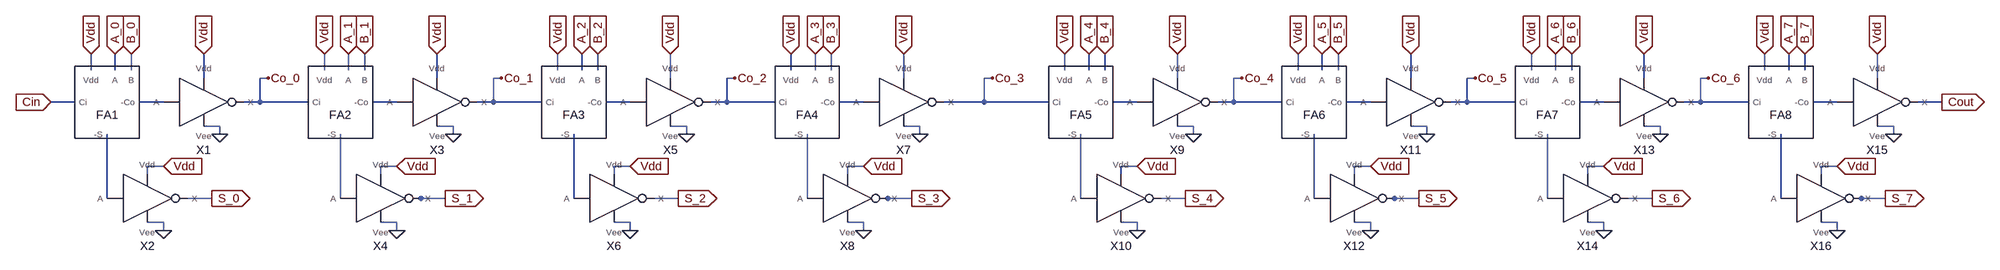
[diagram p0: schematic 8RCAX1.asc]
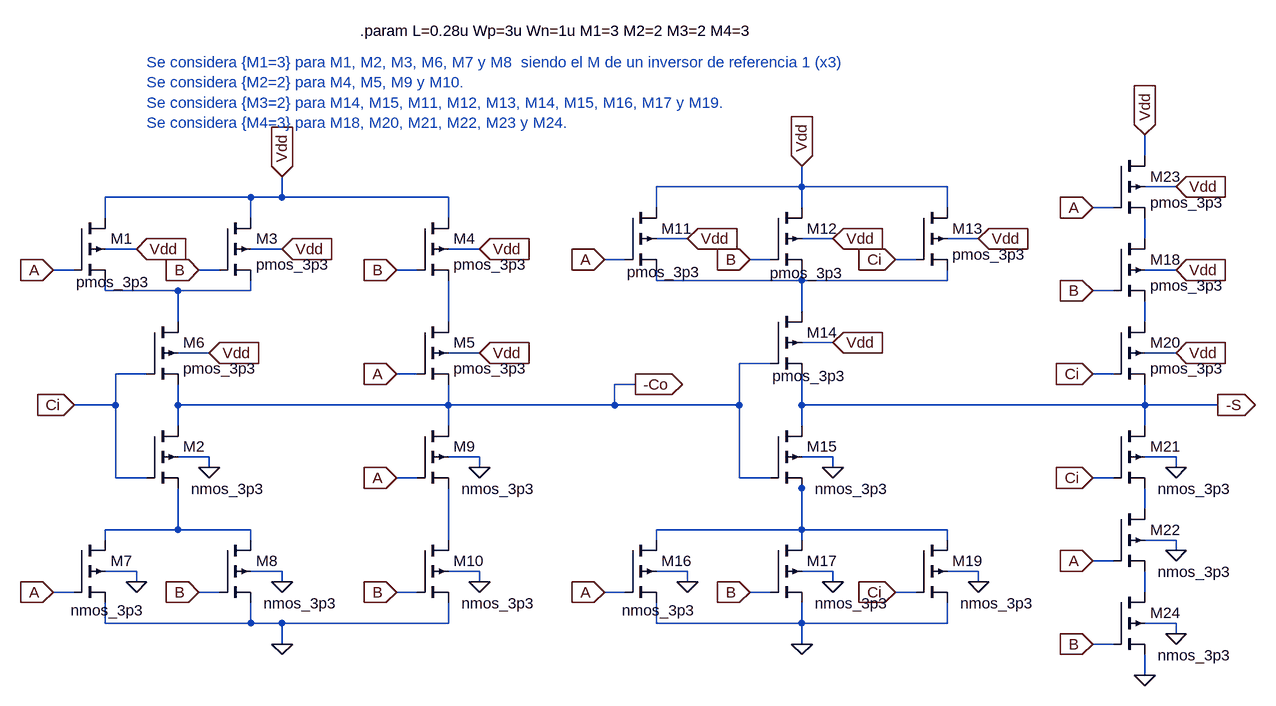
[diagram p1: sub-circuit fax1.asc]
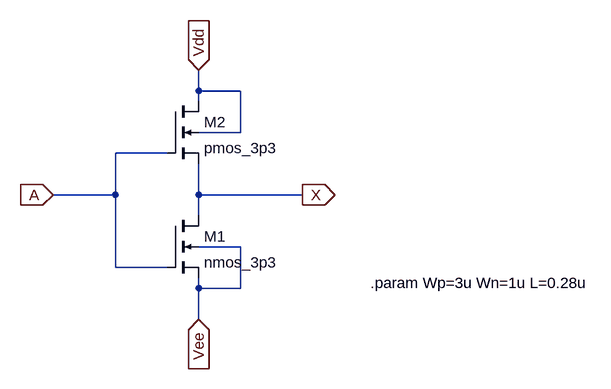
[diagram p2: sub-circuit invx1.asc]
8RCAX1.asc, the LTspice schematic file:
Version 4
SHEET 1 2936 680
WIRE -864 48 -864 16
WIRE -816 48 -816 16
WIRE -784 48 -784 16
WIRE -400 48 -400 16
WIRE -352 48 -352 16
WIRE -320 48 -320 16
WIRE 64 48 64 16
WIRE 112 48 112 16
WIRE 144 48 144 16
WIRE 528 48 528 16
WIRE 576 48 576 16
WIRE 608 48 608 16
WIRE 1072 48 1072 16
WIRE 1120 48 1120 16
WIRE 1152 48 1152 16
WIRE 1536 48 1536 16
WIRE 1584 48 1584 16
WIRE 1616 48 1616 16
WIRE 2000 48 2000 16
WIRE 2048 48 2048 16
WIRE 2080 48 2080 16
WIRE 2464 48 2464 16
WIRE 2512 48 2512 16
WIRE 2544 48 2544 16
WIRE -640 64 -640 16
WIRE -512 64 -528 64
WIRE -176 64 -176 16
WIRE -48 64 -64 64
WIRE 288 64 288 16
WIRE 416 64 400 64
WIRE 752 64 752 16
WIRE 928 64 912 64
WIRE 1296 64 1296 16
WIRE 1424 64 1408 64
WIRE 1760 64 1760 16
WIRE 1888 64 1872 64
WIRE 2224 64 2224 16
WIRE 2352 64 2336 64
WIRE 2688 64 2688 16
WIRE -896 112 -944 112
WIRE -720 112 -768 112
WIRE -528 112 -528 64
WIRE -528 112 -560 112
WIRE -432 112 -528 112
WIRE -256 112 -304 112
WIRE -64 112 -64 64
WIRE -64 112 -96 112
WIRE 32 112 -64 112
WIRE 208 112 160 112
WIRE 400 112 400 64
WIRE 400 112 368 112
WIRE 496 112 400 112
WIRE 672 112 624 112
WIRE 912 112 912 64
WIRE 912 112 832 112
WIRE 1040 112 912 112
WIRE 1216 112 1168 112
WIRE 1408 112 1408 64
WIRE 1408 112 1376 112
WIRE 1504 112 1408 112
WIRE 1680 112 1632 112
WIRE 1872 112 1872 64
WIRE 1872 112 1840 112
WIRE 1968 112 1872 112
WIRE 2144 112 2096 112
WIRE 2336 112 2336 64
WIRE 2336 112 2304 112
WIRE 2432 112 2336 112
WIRE 2608 112 2560 112
WIRE 2816 112 2768 112
WIRE -608 160 -640 160
WIRE -144 160 -176 160
WIRE 320 160 288 160
WIRE 784 160 752 160
WIRE 1328 160 1296 160
WIRE 1792 160 1760 160
WIRE 2256 160 2224 160
WIRE 2720 160 2688 160
WIRE -608 176 -608 160
WIRE -144 176 -144 160
WIRE 320 176 320 160
WIRE 784 176 784 160
WIRE 1328 176 1328 160
WIRE 1792 176 1792 160
WIRE 2256 176 2256 160
WIRE 2720 176 2720 160
WIRE -720 240 -752 240
WIRE -256 240 -288 240
WIRE 208 240 176 240
WIRE 672 240 640 240
WIRE 1216 240 1184 240
WIRE 1680 240 1648 240
WIRE 2144 240 2112 240
WIRE 2608 240 2576 240
WIRE -752 256 -752 240
WIRE -288 256 -288 240
WIRE 176 256 176 240
WIRE 640 256 640 240
WIRE 1184 256 1184 240
WIRE 1648 256 1648 240
WIRE 2112 256 2112 240
WIRE 2576 256 2576 240
WIRE -832 304 -832 176
WIRE -624 304 -672 304
WIRE -368 304 -368 176
WIRE -208 304 -224 304
WIRE -160 304 -208 304
WIRE 96 304 96 176
WIRE 304 304 256 304
WIRE 560 304 560 176
WIRE 720 304 704 304
WIRE 768 304 720 304
WIRE 1104 304 1104 176
WIRE 1312 304 1264 304
WIRE 1568 304 1568 176
WIRE 1728 304 1712 304
WIRE 1776 304 1728 304
WIRE 2032 304 2032 176
WIRE 2240 304 2192 304
WIRE 2496 304 2496 176
WIRE 2656 304 2640 304
WIRE 2704 304 2656 304
WIRE -720 352 -752 352
WIRE -256 352 -288 352
WIRE 208 352 176 352
WIRE 672 352 640 352
WIRE 1216 352 1184 352
WIRE 1680 352 1648 352
WIRE 2144 352 2112 352
WIRE 2608 352 2576 352
WIRE -720 368 -720 352
WIRE -256 368 -256 352
WIRE 208 368 208 352
WIRE 672 368 672 352
WIRE 1216 368 1216 352
WIRE 1680 368 1680 352
WIRE 2144 368 2144 352
WIRE 2608 368 2608 352
FLAG -864 16 Vdd
IOPIN -864 16 In
FLAG -640 16 Vdd
IOPIN -640 16 In
FLAG -608 176 0
FLAG -624 304 S_0
IOPIN -624 304 Out
FLAG -512 64 Co_0
FLAG -400 16 Vdd
IOPIN -400 16 In
FLAG -176 16 Vdd
IOPIN -176 16 In
FLAG -144 176 0
FLAG -160 304 S_1
IOPIN -160 304 Out
FLAG -48 64 Co_1
FLAG 64 16 Vdd
IOPIN 64 16 In
FLAG 288 16 Vdd
IOPIN 288 16 In
FLAG 320 176 0
FLAG 304 304 S_2
IOPIN 304 304 Out
FLAG 416 64 Co_2
FLAG 528 16 Vdd
IOPIN 528 16 In
FLAG 752 16 Vdd
IOPIN 752 16 In
FLAG 784 176 0
FLAG 768 304 S_3
IOPIN 768 304 Out
FLAG -720 240 Vdd
IOPIN -720 240 In
FLAG -256 240 Vdd
IOPIN -256 240 In
FLAG 208 240 Vdd
IOPIN 208 240 In
FLAG 672 240 Vdd
IOPIN 672 240 In
FLAG -720 368 0
FLAG -256 368 0
FLAG 208 368 0
FLAG 672 368 0
FLAG -816 16 A_0
IOPIN -816 16 In
FLAG -784 16 B_0
IOPIN -784 16 In
FLAG -352 16 A_1
IOPIN -352 16 In
FLAG -320 16 B_1
IOPIN -320 16 In
FLAG 112 16 A_2
IOPIN 112 16 In
FLAG 144 16 B_2
IOPIN 144 16 In
FLAG 576 16 A_3
IOPIN 576 16 In
FLAG 608 16 B_3
IOPIN 608 16 In
FLAG 1072 16 Vdd
IOPIN 1072 16 In
FLAG 1296 16 Vdd
IOPIN 1296 16 In
FLAG 1328 176 0
FLAG 1312 304 S_4
IOPIN 1312 304 Out
FLAG 1424 64 Co_4
FLAG 1536 16 Vdd
IOPIN 1536 16 In
FLAG 1760 16 Vdd
IOPIN 1760 16 In
FLAG 1792 176 0
FLAG 1776 304 S_5
IOPIN 1776 304 Out
FLAG 1888 64 Co_5
FLAG 2000 16 Vdd
IOPIN 2000 16 In
FLAG 2224 16 Vdd
IOPIN 2224 16 In
FLAG 2256 176 0
FLAG 2240 304 S_6
IOPIN 2240 304 Out
FLAG 2352 64 Co_6
FLAG 2464 16 Vdd
IOPIN 2464 16 In
FLAG 2688 16 Vdd
IOPIN 2688 16 In
FLAG 2720 176 0
FLAG 2704 304 S_7
IOPIN 2704 304 Out
FLAG 1216 240 Vdd
IOPIN 1216 240 In
FLAG 1680 240 Vdd
IOPIN 1680 240 In
FLAG 2144 240 Vdd
IOPIN 2144 240 In
FLAG 2608 240 Vdd
IOPIN 2608 240 In
FLAG 1216 368 0
FLAG 1680 368 0
FLAG 2144 368 0
FLAG 2608 368 0
FLAG 1120 16 A_4
IOPIN 1120 16 In
FLAG 1152 16 B_4
IOPIN 1152 16 In
FLAG 1584 16 A_5
IOPIN 1584 16 In
FLAG 1616 16 B_5
IOPIN 1616 16 In
FLAG 2048 16 A_6
IOPIN 2048 16 In
FLAG 2080 16 B_6
IOPIN 2080 16 In
FLAG 2512 16 A_7
IOPIN 2512 16 In
FLAG 2544 16 B_7
IOPIN 2544 16 In
FLAG -944 112 Cin
IOPIN -944 112 In
FLAG 2816 112 Cout
IOPIN 2816 112 Out
FLAG 928 64 Co_3
SYMBOL FAX1 -832 112 R0
SYMATTR InstName FA1
SYMBOL INVx1 -640 112 R0
SYMATTR InstName X1
SYMBOL INVx1 -752 304 R0
SYMATTR InstName X2
SYMBOL FAX1 -368 112 R0
SYMATTR InstName FA2
SYMBOL INVx1 -176 112 R0
SYMATTR InstName X3
SYMBOL INVx1 -288 304 R0
SYMATTR InstName X4
SYMBOL FAX1 96 112 R0
SYMATTR InstName FA3
SYMBOL INVx1 288 112 R0
SYMATTR InstName X5
SYMBOL INVx1 176 304 R0
SYMATTR InstName X6
SYMBOL FAX1 560 112 R0
SYMATTR InstName FA4
SYMBOL INVx1 752 112 R0
SYMATTR InstName X7
SYMBOL INVx1 640 304 R0
SYMATTR InstName X8
SYMBOL FAX1 1104 112 R0
SYMATTR InstName FA5
SYMBOL INVx1 1296 112 R0
SYMATTR InstName X9
SYMBOL INVx1 1184 304 R0
SYMATTR InstName X10
SYMBOL FAX1 1568 112 R0
SYMATTR InstName FA6
SYMBOL INVx1 1760 112 R0
SYMATTR InstName X11
SYMBOL INVx1 1648 304 R0
SYMATTR InstName X12
SYMBOL FAX1 2032 112 R0
SYMATTR InstName FA7
SYMBOL INVx1 2224 112 R0
SYMATTR InstName X13
SYMBOL INVx1 2112 304 R0
SYMATTR InstName X14
SYMBOL FAX1 2496 112 R0
SYMATTR InstName FA8
SYMBOL INVx1 2688 112 R0
SYMATTR InstName X15
SYMBOL INVx1 2576 304 R0
SYMATTR InstName X16

fax1.asc, the sub-circuit schematic file:
Version 4
SHEET 1 1704 1284
WIRE 1440 -784 1440 -816
WIRE 912 -736 912 -768
WIRE 912 -736 688 -736
WIRE 1136 -736 912 -736
WIRE 1488 -736 1440 -736
WIRE 64 -720 -160 -720
WIRE 112 -720 112 -752
WIRE 112 -720 64 -720
WIRE 368 -720 112 -720
WIRE 688 -704 688 -736
WIRE 912 -704 912 -736
WIRE 1136 -704 1136 -736
WIRE 1392 -704 1360 -704
WIRE -160 -688 -160 -720
WIRE 64 -688 64 -720
WIRE 368 -688 368 -720
WIRE 736 -656 688 -656
WIRE 960 -656 912 -656
WIRE 1184 -656 1136 -656
WIRE 1440 -656 1440 -688
WIRE -112 -640 -160 -640
WIRE 112 -640 64 -640
WIRE 416 -640 368 -640
WIRE 640 -624 608 -624
WIRE 864 -624 832 -624
WIRE 1088 -624 1056 -624
WIRE -208 -608 -240 -608
WIRE 16 -608 -16 -608
WIRE 320 -608 288 -608
WIRE 1488 -608 1440 -608
WIRE 688 -592 688 -608
WIRE 912 -592 912 -608
WIRE 912 -592 688 -592
WIRE 1136 -592 1136 -608
WIRE 1136 -592 912 -592
WIRE -160 -576 -160 -592
WIRE -48 -576 -160 -576
WIRE 64 -576 64 -592
WIRE 64 -576 -48 -576
WIRE 1392 -576 1360 -576
WIRE 912 -544 912 -592
WIRE -48 -528 -48 -576
WIRE 368 -528 368 -592
WIRE 1440 -528 1440 -560
WIRE 960 -496 912 -496
WIRE 0 -480 -48 -480
WIRE 416 -480 368 -480
WIRE 1488 -480 1440 -480
WIRE 864 -464 816 -464
WIRE -96 -448 -144 -448
WIRE 320 -448 288 -448
WIRE 1392 -448 1360 -448
WIRE 656 -432 624 -432
WIRE -144 -400 -144 -448
WIRE -144 -400 -208 -400
WIRE -48 -400 -48 -432
WIRE 368 -400 368 -432
WIRE 368 -400 -48 -400
WIRE 624 -400 624 -432
WIRE 624 -400 368 -400
WIRE 816 -400 816 -464
WIRE 816 -400 624 -400
WIRE 912 -400 912 -448
WIRE 1440 -400 1440 -432
WIRE 1440 -400 912 -400
WIRE 1552 -400 1440 -400
WIRE -48 -368 -48 -400
WIRE 368 -368 368 -400
WIRE 912 -368 912 -400
WIRE 1440 -368 1440 -400
WIRE 0 -320 -48 -320
WIRE 416 -320 368 -320
WIRE 960 -320 912 -320
WIRE 1488 -320 1440 -320
WIRE 0 -304 0 -320
WIRE 416 -304 416 -320
WIRE 960 -304 960 -320
WIRE 1488 -304 1488 -320
WIRE -144 -288 -144 -400
WIRE -96 -288 -144 -288
WIRE 320 -288 288 -288
WIRE 816 -288 816 -400
WIRE 864 -288 816 -288
WIRE 1392 -288 1360 -288
WIRE 912 -272 912 -288
WIRE 1440 -240 1440 -272
WIRE -48 -208 -48 -272
WIRE -48 -208 -160 -208
WIRE 64 -208 -48 -208
WIRE 912 -208 912 -272
WIRE 912 -208 688 -208
WIRE 1136 -208 912 -208
WIRE -160 -192 -160 -208
WIRE 64 -192 64 -208
WIRE 368 -192 368 -272
WIRE 688 -192 688 -208
WIRE 912 -192 912 -208
WIRE 1136 -192 1136 -208
WIRE 1488 -192 1440 -192
WIRE 1488 -176 1488 -192
WIRE 1392 -160 1360 -160
WIRE -112 -144 -160 -144
WIRE 112 -144 64 -144
WIRE 416 -144 368 -144
WIRE 736 -144 688 -144
WIRE 960 -144 912 -144
WIRE 1184 -144 1136 -144
WIRE -112 -128 -112 -144
WIRE 112 -128 112 -144
WIRE 416 -128 416 -144
WIRE 736 -128 736 -144
WIRE 960 -128 960 -144
WIRE 1184 -128 1184 -144
WIRE -208 -112 -240 -112
WIRE 16 -112 -16 -112
WIRE 320 -112 288 -112
WIRE 640 -112 608 -112
WIRE 864 -112 832 -112
WIRE 1088 -112 1056 -112
WIRE 1440 -112 1440 -144
WIRE -160 -64 -160 -96
WIRE 64 -64 64 -96
WIRE 64 -64 -160 -64
WIRE 112 -64 64 -64
WIRE 368 -64 368 -96
WIRE 368 -64 112 -64
WIRE 688 -64 688 -96
WIRE 912 -64 912 -96
WIRE 912 -64 688 -64
WIRE 1136 -64 1136 -96
WIRE 1136 -64 912 -64
WIRE 1488 -64 1440 -64
WIRE 1488 -48 1488 -64
WIRE 112 -32 112 -64
WIRE 912 -32 912 -64
WIRE 1392 -32 1360 -32
WIRE 1440 16 1440 -16
FLAG -112 -640 Vdd
IOPIN -112 -640 In
FLAG 0 -304 0
FLAG 112 -640 Vdd
IOPIN 112 -640 In
FLAG 416 -640 Vdd
IOPIN 416 -640 In
FLAG 416 -480 Vdd
IOPIN 416 -480 In
FLAG 0 -480 Vdd
IOPIN 0 -480 In
FLAG -112 -128 0
FLAG 112 -128 0
FLAG 416 -304 0
FLAG 416 -128 0
FLAG 112 -32 0
FLAG -208 -400 Ci
IOPIN -208 -400 In
FLAG -240 -608 A
IOPIN -240 -608 In
FLAG -240 -112 A
IOPIN -240 -112 In
FLAG 288 -448 A
IOPIN 288 -448 In
FLAG 288 -288 A
IOPIN 288 -288 In
FLAG 288 -112 B
IOPIN 288 -112 In
FLAG -16 -112 B
IOPIN -16 -112 In
FLAG -16 -608 B
IOPIN -16 -608 In
FLAG 288 -608 B
IOPIN 288 -608 In
FLAG 112 -752 Vdd
IOPIN 112 -752 In
FLAG 736 -656 Vdd
IOPIN 736 -656 In
FLAG 960 -656 Vdd
IOPIN 960 -656 In
FLAG 1184 -656 Vdd
IOPIN 1184 -656 In
FLAG 608 -624 A
IOPIN 608 -624 In
FLAG 832 -624 B
IOPIN 832 -624 In
FLAG 1056 -624 Ci
IOPIN 1056 -624 In
FLAG 912 -768 Vdd
IOPIN 912 -768 In
FLAG 960 -496 Vdd
IOPIN 960 -496 In
FLAG 960 -304 0
FLAG 736 -128 0
FLAG 960 -128 0
FLAG 1184 -128 0
FLAG 912 -32 0
FLAG 608 -112 A
IOPIN 608 -112 In
FLAG 1056 -112 Ci
IOPIN 1056 -112 In
FLAG 832 -112 B
IOPIN 832 -112 In
FLAG 1488 -608 Vdd
IOPIN 1488 -608 In
FLAG 1488 -480 Vdd
IOPIN 1488 -480 In
FLAG 1488 -304 0
FLAG 1488 -176 0
FLAG 1360 -448 Ci
IOPIN 1360 -448 In
FLAG 1360 -288 Ci
IOPIN 1360 -288 In
FLAG 1360 -160 A
IOPIN 1360 -160 In
FLAG 1360 -576 B
IOPIN 1360 -576 In
FLAG 1488 -736 Vdd
IOPIN 1488 -736 In
FLAG 1360 -704 A
IOPIN 1360 -704 In
FLAG 1488 -48 0
FLAG 1360 -32 B
IOPIN 1360 -32 In
FLAG 1440 16 0
FLAG 1440 -816 Vdd
IOPIN 1440 -816 In
FLAG 1552 -400 -S
IOPIN 1552 -400 Out
FLAG 656 -432 -Co
IOPIN 656 -432 Out
SYMBOL pmos4 -208 -688 R0
WINDOW 3 3 99 Left 2
SYMATTR Value pmos_3p3
SYMATTR InstName M1
SYMATTR Value2 l={L} w={Wp} m={M1}
SYMBOL pmos4 -96 -368 R0
WINDOW 3 68 97 Left 2
SYMATTR Value nmos_3p3
SYMATTR InstName M2
SYMATTR Value2 l={L} w={Wn} m={M1}
SYMBOL pmos4 16 -688 R0
SYMATTR InstName M3
SYMATTR Value pmos_3p3
SYMATTR Value2 l={L} w={Wp} m={M1}
SYMBOL pmos4 320 -688 R0
SYMATTR InstName M4
SYMATTR Value pmos_3p3
SYMATTR Value2 l={L} w={Wp} m={M2}
SYMBOL pmos4 320 -528 R0
SYMATTR InstName M5
SYMATTR Value pmos_3p3
SYMATTR Value2 l={L} w={Wp} m={M2}
SYMBOL pmos4 -96 -528 R0
SYMATTR InstName M6
SYMATTR Value pmos_3p3
SYMATTR Value2 l={L} w={Wp} m={M1}
SYMBOL pmos4 -208 -192 R0
WINDOW 3 -5 108 Left 2
SYMATTR Value nmos_3p3
SYMATTR InstName M7
SYMATTR Value2 l={L} w={Wn} m={M1}
SYMBOL pmos4 16 -192 R0
WINDOW 3 68 97 Left 2
SYMATTR Value nmos_3p3
SYMATTR InstName M8
SYMATTR Value2 l={L} w={Wn} m={M1}
SYMBOL pmos4 320 -368 R0
WINDOW 3 68 97 Left 2
SYMATTR Value nmos_3p3
SYMATTR InstName M9
SYMATTR Value2 l={L} w={Wn} m={M2}
SYMBOL pmos4 320 -192 R0
WINDOW 3 68 97 Left 2
SYMATTR Value nmos_3p3
SYMATTR InstName M10
SYMATTR Value2 l={L} w={Wn} m={M2}
SYMBOL pmos4 640 -704 R0
WINDOW 3 3 99 Left 2
SYMATTR Value pmos_3p3
SYMATTR InstName M11
SYMATTR Value2 l={L} w={Wp} m={M3}
SYMBOL pmos4 864 -704 R0
WINDOW 3 -1 101 Left 2
SYMATTR Value pmos_3p3
SYMATTR InstName M12
SYMATTR Value2 l={L} w={Wp} m={M3}
SYMBOL pmos4 1088 -704 R0
SYMATTR InstName M13
SYMATTR Value pmos_3p3
SYMATTR Value2 l={L} w={Wp} m={M3}
SYMBOL pmos4 864 -544 R0
WINDOW 3 3 99 Left 2
SYMATTR Value pmos_3p3
SYMATTR InstName M14
SYMATTR Value2 l={L} w={Wp} m={M3}
SYMBOL pmos4 864 -368 R0
WINDOW 3 68 97 Left 2
SYMATTR Value nmos_3p3
SYMATTR InstName M15
SYMATTR Value2 l={L} w={Wn} m={M3}
SYMBOL pmos4 640 -192 R0
WINDOW 3 -5 108 Left 2
SYMATTR Value nmos_3p3
SYMATTR InstName M16
SYMATTR Value2 l={L} w={Wn} m={M3}
SYMBOL pmos4 864 -192 R0
WINDOW 3 68 97 Left 2
SYMATTR Value nmos_3p3
SYMATTR InstName M17
SYMATTR Value2 l={L} w={Wn} m={M3}
SYMBOL pmos4 1088 -192 R0
WINDOW 3 68 97 Left 2
SYMATTR Value nmos_3p3
SYMATTR InstName M19
SYMATTR Value2 l={L} w={Wn} m={M3}
SYMBOL pmos4 1392 -656 R0
SYMATTR InstName M18
SYMATTR Value pmos_3p3
SYMATTR Value2 l={L} w={Wp}
SYMBOL pmos4 1392 -528 R0
SYMATTR InstName M20
SYMATTR Value pmos_3p3
SYMATTR Value2 l={L} w={Wp}
SYMBOL pmos4 1392 -368 R0
WINDOW 3 68 97 Left 2
SYMATTR Value nmos_3p3
SYMATTR InstName M21
SYMATTR Value2 l={L} w={Wn}
SYMBOL pmos4 1392 -240 R0
WINDOW 3 68 97 Left 2
SYMATTR Value nmos_3p3
SYMATTR InstName M22
SYMATTR Value2 l={L} w={Wn}
SYMBOL pmos4 1392 -784 R0
SYMATTR InstName M23
SYMATTR Value pmos_3p3
SYMATTR Value2 l={L} w={Wp}
SYMBOL pmos4 1392 -112 R0
WINDOW 3 68 97 Left 2
SYMATTR Value nmos_3p3
SYMATTR InstName M24
SYMATTR Value2 l={L} w={Wn}
TEXT 232 -976 Left 2 !.param L=0.28u Wp=3u Wn=1u M1=3 M2=2 M3=2 M4=3
TEXT -96 -928 Left 2 ;Se considera {M1=3} para M1, M2, M3, M6, M7 y M8  siendo el M de un inversor de referencia 1 (x3)\nSe considera {M2=2} para M4, M5, M9 y M10.\nSe considera {M3=2} para M14, M15, M11, M12, M13, M14, M15, M16, M17 y M19.\nSe considera {M4=3} para M18, M20, M21, M22, M23 y M24.

invx1.asc, the sub-circuit schematic file:
Version 4
SHEET 1 2776 836
WIRE 416 -16 416 -48
WIRE 480 -16 416 -16
WIRE 416 0 416 -16
WIRE 480 48 480 -16
WIRE 480 48 416 48
WIRE 368 80 288 80
WIRE 288 144 288 80
WIRE 288 144 192 144
WIRE 416 144 416 96
WIRE 576 144 416 144
WIRE 416 176 416 144
WIRE 480 224 416 224
WIRE 288 256 288 144
WIRE 368 256 288 256
WIRE 416 288 416 272
WIRE 480 288 480 224
WIRE 480 288 416 288
WIRE 416 336 416 288
FLAG 416 -48 Vdd
IOPIN 416 -48 In
FLAG 192 144 A
IOPIN 192 144 In
FLAG 576 144 X
IOPIN 576 144 Out
FLAG 416 336 Vee
IOPIN 416 336 In
SYMBOL nmos4 368 176 R0
SYMATTR InstName M1
SYMATTR Value nmos_3p3
SYMATTR Value2 l={L} w={Wn}
SYMBOL nmos4 368 0 R0
SYMATTR InstName M2
SYMATTR Value pmos_3p3
SYMATTR Value2 l={L} w={Wp}
TEXT 680 280 Left 2 !.param Wp=3u Wn=1u L=0.28u

The netlist it stands for:
* 8RCAX1.asc
XFA1 A_0 B_0 Cin Vdd N001 N009 fax1
XX1 N001 Vdd Co_0 0 invx1
XX2 N009 Vdd S_0 0 invx1
XFA2 A_1 B_1 Co_0 Vdd N002 N010 fax1
XX3 N002 Vdd Co_1 0 invx1
XX4 N010 Vdd S_1 0 invx1
XFA3 A_2 B_2 Co_1 Vdd N003 N011 fax1
XX5 N003 Vdd Co_2 0 invx1
XX6 N011 Vdd S_2 0 invx1
XFA4 A_3 B_3 Co_2 Vdd N004 N012 fax1
XX7 N004 Vdd Co_3 0 invx1
XX8 N012 Vdd S_3 0 invx1
XFA5 A_4 B_4 Co_3 Vdd N005 N013 fax1
XX9 N005 Vdd Co_4 0 invx1
XX10 N013 Vdd S_4 0 invx1
XFA6 A_5 B_5 Co_4 Vdd N006 N014 fax1
XX11 N006 Vdd Co_5 0 invx1
XX12 N014 Vdd S_5 0 invx1
XFA7 A_6 B_6 Co_5 Vdd N007 N015 fax1
XX13 N007 Vdd Co_6 0 invx1
XX14 N015 Vdd S_6 0 invx1
XFA8 A_7 B_7 Co_6 Vdd N008 N016 fax1
XX15 N008 Vdd Cout 0 invx1
XX16 N016 Vdd S_7 0 invx1

* block symbol definitions
.subckt fax1 A B Ci Vdd -Co -S
M1 Vdd A N003 Vdd pmos_3p3 l={L} w={Wp} m={M1}
M2 -Co Ci N008 0 nmos_3p3 l={L} w={Wn} m={M1}
M3 Vdd B N003 Vdd pmos_3p3 l={L} w={Wp} m={M1}
M4 Vdd B N004 Vdd pmos_3p3 l={L} w={Wp} m={M2}
M5 N004 A -Co Vdd pmos_3p3 l={L} w={Wp} m={M2}
M6 N003 Ci -Co Vdd pmos_3p3 l={L} w={Wp} m={M1}
M7 N008 A 0 0 nmos_3p3 l={L} w={Wn} m={M1}
M8 N008 B 0 0 nmos_3p3 l={L} w={Wn} m={M1}
M9 -Co A N009 0 nmos_3p3 l={L} w={Wn} m={M2}
M10 N009 B 0 0 nmos_3p3 l={L} w={Wn} m={M2}
M11 Vdd A N002 Vdd pmos_3p3 l={L} w={Wp} m={M3}
M12 Vdd B N002 Vdd pmos_3p3 l={L} w={Wp} m={M3}
M13 Vdd Ci N002 Vdd pmos_3p3 l={L} w={Wp} m={M3}
M14 N002 -Co -S Vdd pmos_3p3 l={L} w={Wp} m={M3}
M15 -S -Co N006 0 nmos_3p3 l={L} w={Wn} m={M3}
M16 N006 A 0 0 nmos_3p3 l={L} w={Wn} m={M3}
M17 N006 B 0 0 nmos_3p3 l={L} w={Wn} m={M3}
M19 N006 Ci 0 0 nmos_3p3 l={L} w={Wn} m={M3}
M18 N001 B N005 Vdd pmos_3p3 l={L} w={Wp}
M20 N005 Ci -S Vdd pmos_3p3 l={L} w={Wp}
M21 -S Ci N007 0 nmos_3p3 l={L} w={Wn}
M22 N007 A N010 0 nmos_3p3 l={L} w={Wn}
M23 Vdd A N001 Vdd pmos_3p3 l={L} w={Wp}
M24 N010 B 0 0 nmos_3p3 l={L} w={Wn}
.param L=0.28u Wp=3u Wn=1u M1=3 M2=2 M3=2 M4=3
* Se considera {M1=3} para M1, M2, M3, M6, M7 y M8  siendo el M de un inversor de referencia 1 (x3)
* Se considera {M2=2} para M4, M5, M9 y M10.
* Se considera {M3=2} para M14, M15, M11, M12, M13, M14, M15, M16, M17 y M19.
* Se considera {M4=3} para M18, M20, M21, M22, M23 y M24.
.ends fax1

.subckt invx1 A Vdd X Vee
M1 X A Vee Vee nmos_3p3 l={L} w={Wn}
M2 Vdd A X Vdd pmos_3p3 l={L} w={Wp}
.param Wp=3u Wn=1u L=0.28u
.ends invx1

.model NMOS NMOS
.model PMOS PMOS
.lib standard.mos
.backanno
.end